# EAGLE design ALU_TheoreticalDiagram (EAGLE 8.3.1)
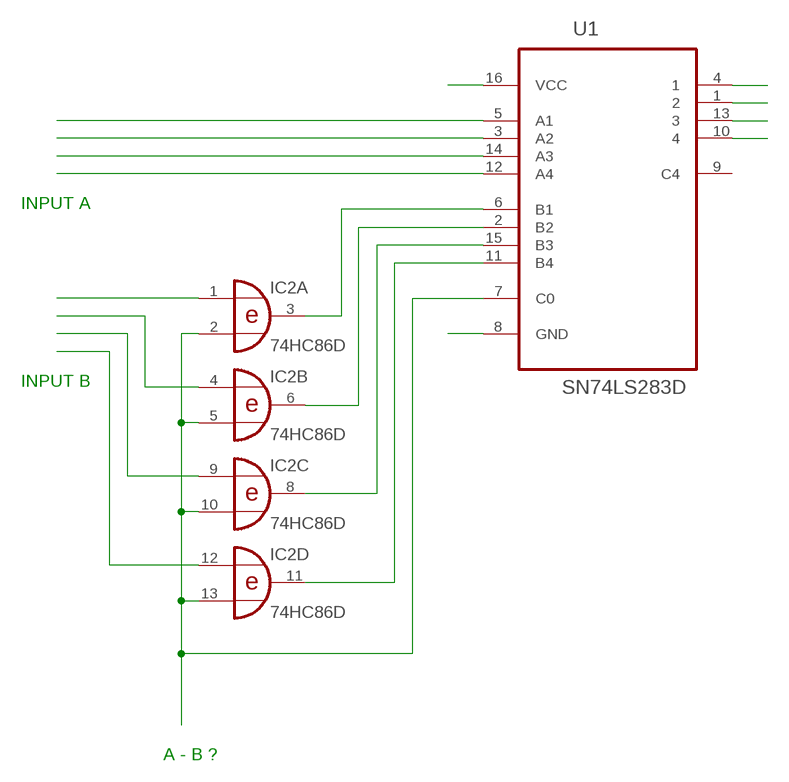
[diagram p0: schematic, sheet 1]

## Parts
IC2  74HC86D  [SO14]
U1  SN74LS283D  [SOIC127P600X175-16N]

## Nets
N$1: IC2.1(A:I0)
N$2: IC2.4(B:I0)
N$3: IC2.9(C:I0)
N$4: IC2.12(D:I0)
N$5: IC2.2(A:I1) IC2.5(B:I1) IC2.10(C:I1) IC2.13(D:I1) U1.7(C0)
N$6: U1.14(A3)
N$7: IC2.6(B:O) U1.2(B2)
N$8: IC2.8(C:O) U1.15(B3)
N$9: IC2.11(D:O) U1.11(B4)
N$10: IC2.3(A:O) U1.6(B1)
N$11: U1.12(A4)
N$12: U1.3(A2)
N$13: U1.5(A1)
N$14: U1.8(GND)
N$16: U1.4
N$17: U1.1
N$18: U1.13
N$19: U1.10
VCC: U1.16(VCC)
Unconnected: U1.9(C4)

## Notes on the sheet
- INPUT A
- INPUT B
- A - B ?

## Power pins joined to a net without a drawn wire
GND: IC2.7(P:GND)
VCC: IC2.14(P:VCC)

## Library data of the parts
IC2 = 74xx-eu:74*86: Quad 2-input EXCLUSIVE-OR (XOR) gate
U1 = SN74LS283D:SN74LS283D: IC BIN FULL 4BIT ADD CARRY; MPN: SN74LS283D; OC_FARNELL: 1750356; OC_NEWARK: 50R6549; PACKAGE: 16-SOIC; SUPPLIER: Texas Instruments

## Board
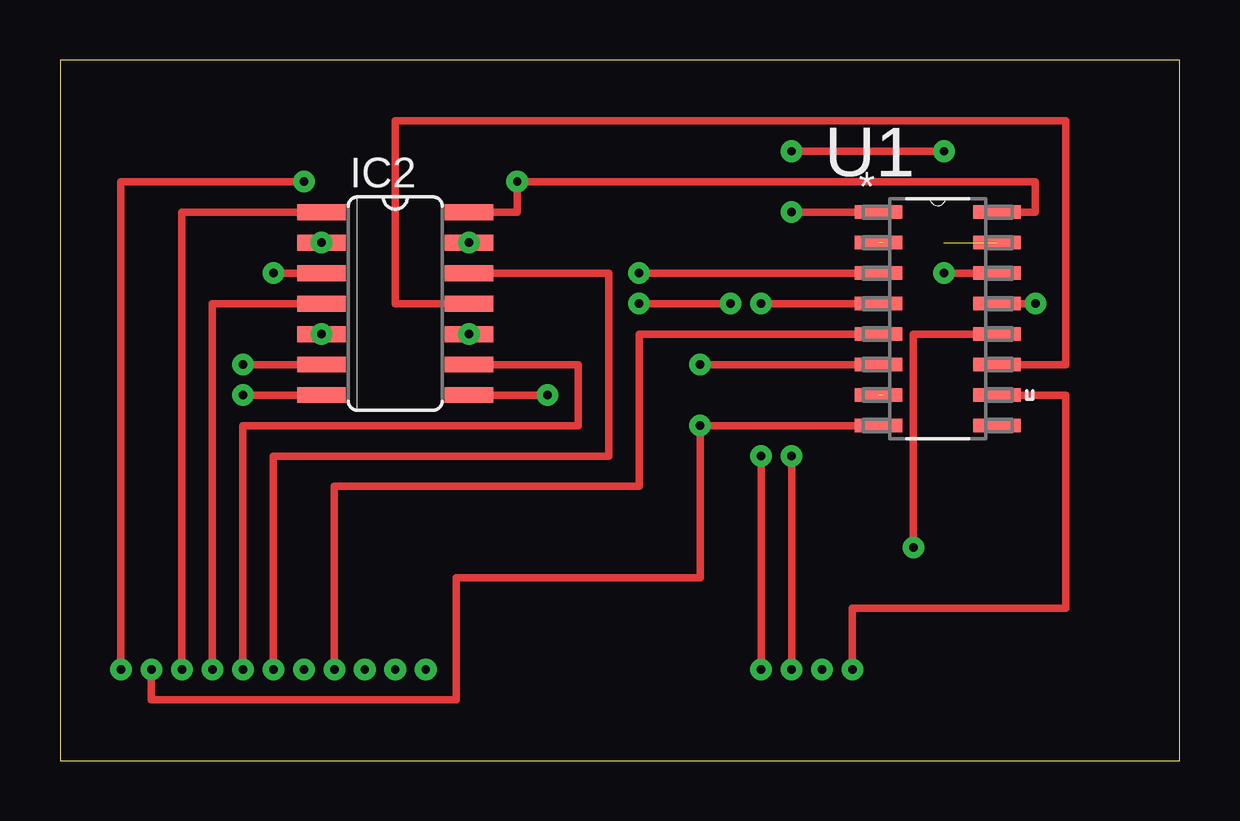
[diagram p1: board, top side]
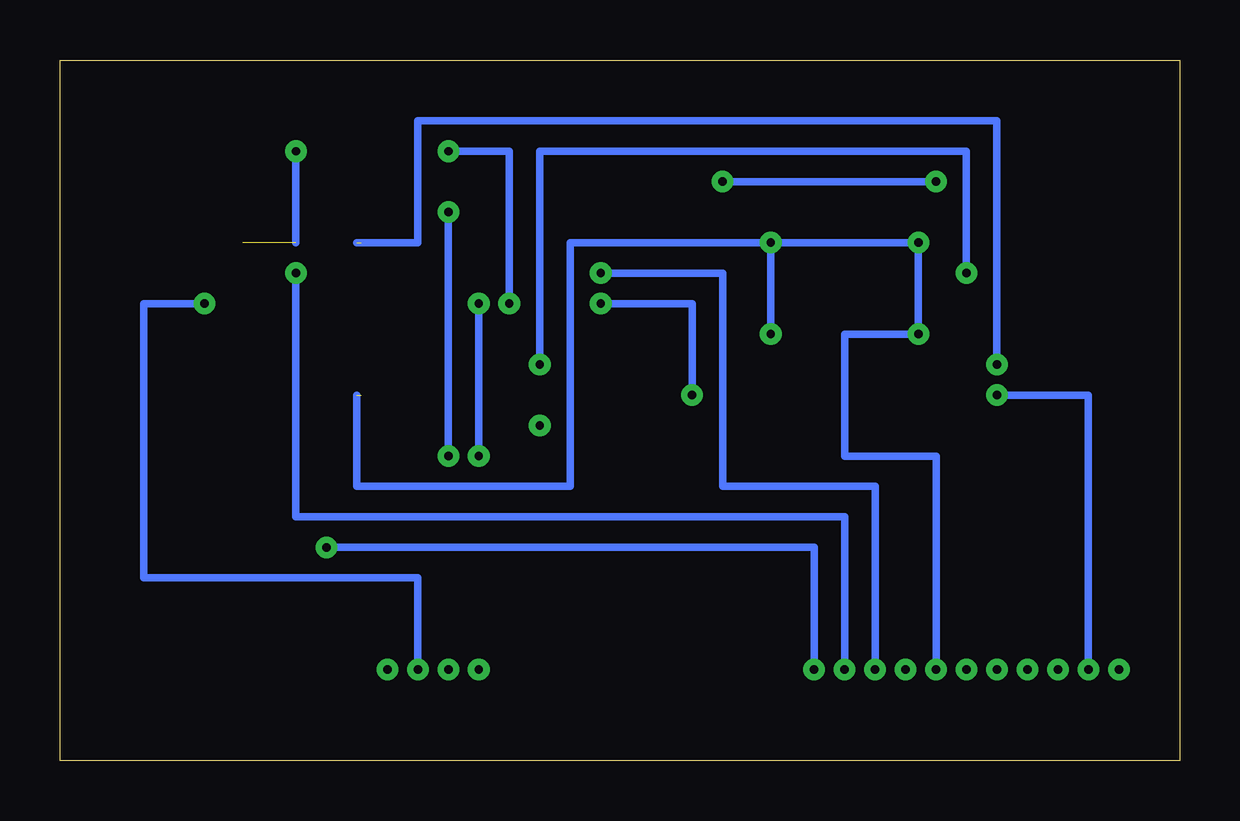
[diagram p2: board, bottom side, seen from below]

Size 46.66 x 29.2 mm. Coordinates in mm from the lower left corner, seen from the top.
Outline: 0,0 46.66,0 46.66,29.2 0,29.2 0,0
Copper layers (1*16): Top 0.035mm / dielectric 1.5mm / Bottom 0.035mm
Design rules "default": minimum track width 6mil, minimum drill 0.35mm, track to track 6mil, track to pad 6mil, pad to pad 6mil, via to via 6mil, smd to smd 6mil, copper to edge 40mil, drill to drill 6mil, minimum pad ring 10mil, minimum via ring 8mil, stop-mask expansion 4mil, vias tented up to drill 0mil, thermal gap 10mil

### Footprints (pad centres in the part's own frame; a part is rotated, then mirrored left to right if it is on the bottom)
SO14 = smd 0.66 x 2.032: 1 -3.81,-3.073; 2 -2.54,-3.073; 3 -1.27,-3.073; 4 0,-3.073; 5 1.27,-3.073; 6 2.54,-3.073; 7 3.81,-3.073; 8 3.81,3.073; 9 2.54,3.073; 10 1.27,3.073; 11 0,3.073; 12 -1.27,3.073; 13 -2.54,3.073; 14 -3.81,3.073
SOIC127P600X175-16N = smd 1.981 x 0.559: 1 -2.464,4.445; 2 -2.464,3.175; 3 -2.464,1.905; 4 -2.464,0.635; 5 -2.464,-0.635; 6 -2.464,-1.905; 7 -2.464,-3.175; 8 -2.464,-4.445; 9 2.464,-4.445; 10 2.464,-3.175; 11 2.464,-1.905; 12 2.464,-0.635; 13 2.464,0.635; 14 2.464,1.905; 15 2.464,3.175; 16 2.464,4.445

### Placement (x,y rotation side)
IC2  13.97,19.05 270 top
U1  36.58,18.41 0 top

### Tracks (layer width: path | path; a pad name or v marks a point on that pad's centre or on a via)
GND  (via drill 0.35 pad 0.9)
  Top 0.305: IC2.7 v7.62,15.24 | v3.81,3.81 3.81,2.62
  Bottom 0.305: v7.62,15.24 3.81,15.24 v3.81,3.81
N$1  (via drill 0.35 pad 0.9)
  Top 0.305: IC2.1 5.08,22.86 v5.08,3.81
N$2  (via drill 0.35 pad 0.9)
  Top 0.305: IC2.4 6.35,19.05 v6.35,3.81
N$3  (via drill 0.35 pad 0.9)
  Top 0.305: v7.62,3.81 7.62,13.97 21.59,13.97 21.59,16.51 IC2.9
N$4  (via drill 0.35 pad 0.9)
  Top 0.305: IC2.12 22.86,20.32 22.86,12.7 8.89,12.7 v8.89,3.81
N$5  (via drill 0.35 pad 0.9)  (1 unrouted)
  Bottom 0.305: IC2.13 IC2.2 IC2.5 13.97,17.78 13.97,12.7 10.16,12.7 v10.16,3.81 | IC2.13 IC2.10 | IC2.13 25.4,21.59 25.4,11.43 34.29,11.43 34.29,15.24
  other vias: 10.9,17.78 10.9,21.59 17.04,21.59 17.04,17.78
N$6  (via drill 0.35 pad 0.9)
  Top 0.305: U1.14 v36.83,20.32
  Bottom 0.305: v36.83,20.32 36.83,10.16 13.97,10.16 v13.97,3.81
N$7  (via drill 0.35 pad 0.9)  (1 unrouted)
  Top 0.305: IC2.6 v7.62,16.51
  Bottom 0.305: v7.62,16.51 7.62,26.67 31.75,26.67 31.75,21.59 34.29,21.59
N$8  (via drill 0.35 pad 0.9)  (1 unrouted)
  Top 0.305: IC2.8 v20.32,15.24 | v24.13,19.05 v27.94,19.05 | v30.48,25.4 v36.83,25.4
  Bottom 0.305: v20.32,15.24 20.32,19.05 v24.13,19.05 | v27.94,19.05 27.94,25.4 v30.48,25.4 | v36.83,25.4 36.83,21.59
N$9
  Top 0.305: IC2.11 13.97,19.05 13.97,26.67 41.91,26.67 41.91,16.51 U1.11
N$10  (via drill 0.35 pad 0.9)
  Top 0.305: U1.6 v26.67,16.51 | IC2.3 v8.89,20.32
  Bottom 0.305: v8.89,20.32 8.89,25.4 26.67,25.4 v26.67,16.51
N$11  (via drill 0.35 pad 0.9)
  Top 0.305: U1.12 35.56,17.78 v35.56,8.89
  Bottom 0.305: v35.56,8.89 15.24,8.89 v15.24,3.81
N$12  (via drill 0.35 pad 0.9)
  Top 0.305: U1.3 v24.13,20.32
  Bottom 0.305: v12.7,3.81 12.7,11.43 19.05,11.43 19.05,20.32 v24.13,20.32
N$13  (via drill 0.35 pad 0.9)
  Top 0.305: U1.5 24.13,17.78 24.13,11.43 11.43,11.43 v11.43,3.81
N$14  (via drill 0.35 pad 0.9)
  Top 0.305: U1.8 v26.67,13.97 26.67,7.62 16.51,7.62 16.51,2.54 3.81,2.54
N$16  (via drill 0.35 pad 0.9)
  Top 0.305: U1.4 v29.21,19.05 | v29.21,12.7 v29.21,3.81
  Bottom 0.305: v29.21,19.05 v29.21,12.7
N$17  (via drill 0.35 pad 0.9)
  Top 0.305: U1.1 v30.48,22.86 | v30.48,12.7 v30.48,3.81
  Bottom 0.305: v30.48,22.86 v30.48,12.7
N$18  (via drill 0.35 pad 0.9)
  Top 0.305: U1.13 v40.64,19.05
  Bottom 0.305: v40.64,19.05 43.18,19.05 43.18,7.62 31.75,7.62 v31.75,3.81
N$19  (via drill 0.35 pad 0.9)
  Top 0.305: U1.10 41.91,15.24 41.91,6.35 33.02,6.35 v33.02,3.81
VCC  (via drill 0.35 pad 0.9)
  Top 0.305: IC2.14 19.05,22.86 v19.05,24.13 40.64,24.13 40.64,22.86 U1.16 | v10.16,24.13 2.54,24.13 v2.54,3.81
  Bottom 0.305: v19.05,24.13 v10.16,24.13